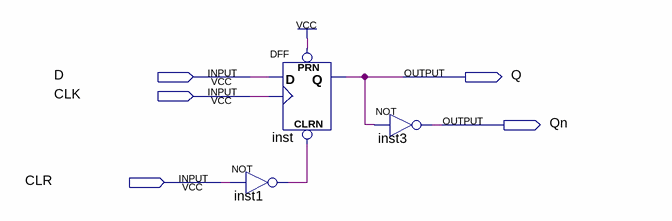
[diagram p0: schematic sheet]
// Quartus schematic Dff_M.bdf as structural Verilog: 3 symbols, 5 pins
module Dff_M (
  input  D,
  input  CLK,
  input  CLR,
  output Q,
  output Qn
);

  wire inst1_out;

  DFF inst (.CLRN(inst1_out), .CLK(CLK), .D(D), .PRN(1'b1), .Q(Q));
  not inst1 (inst1_out, CLR);
  not inst3 (Qn, Q);
endmodule
